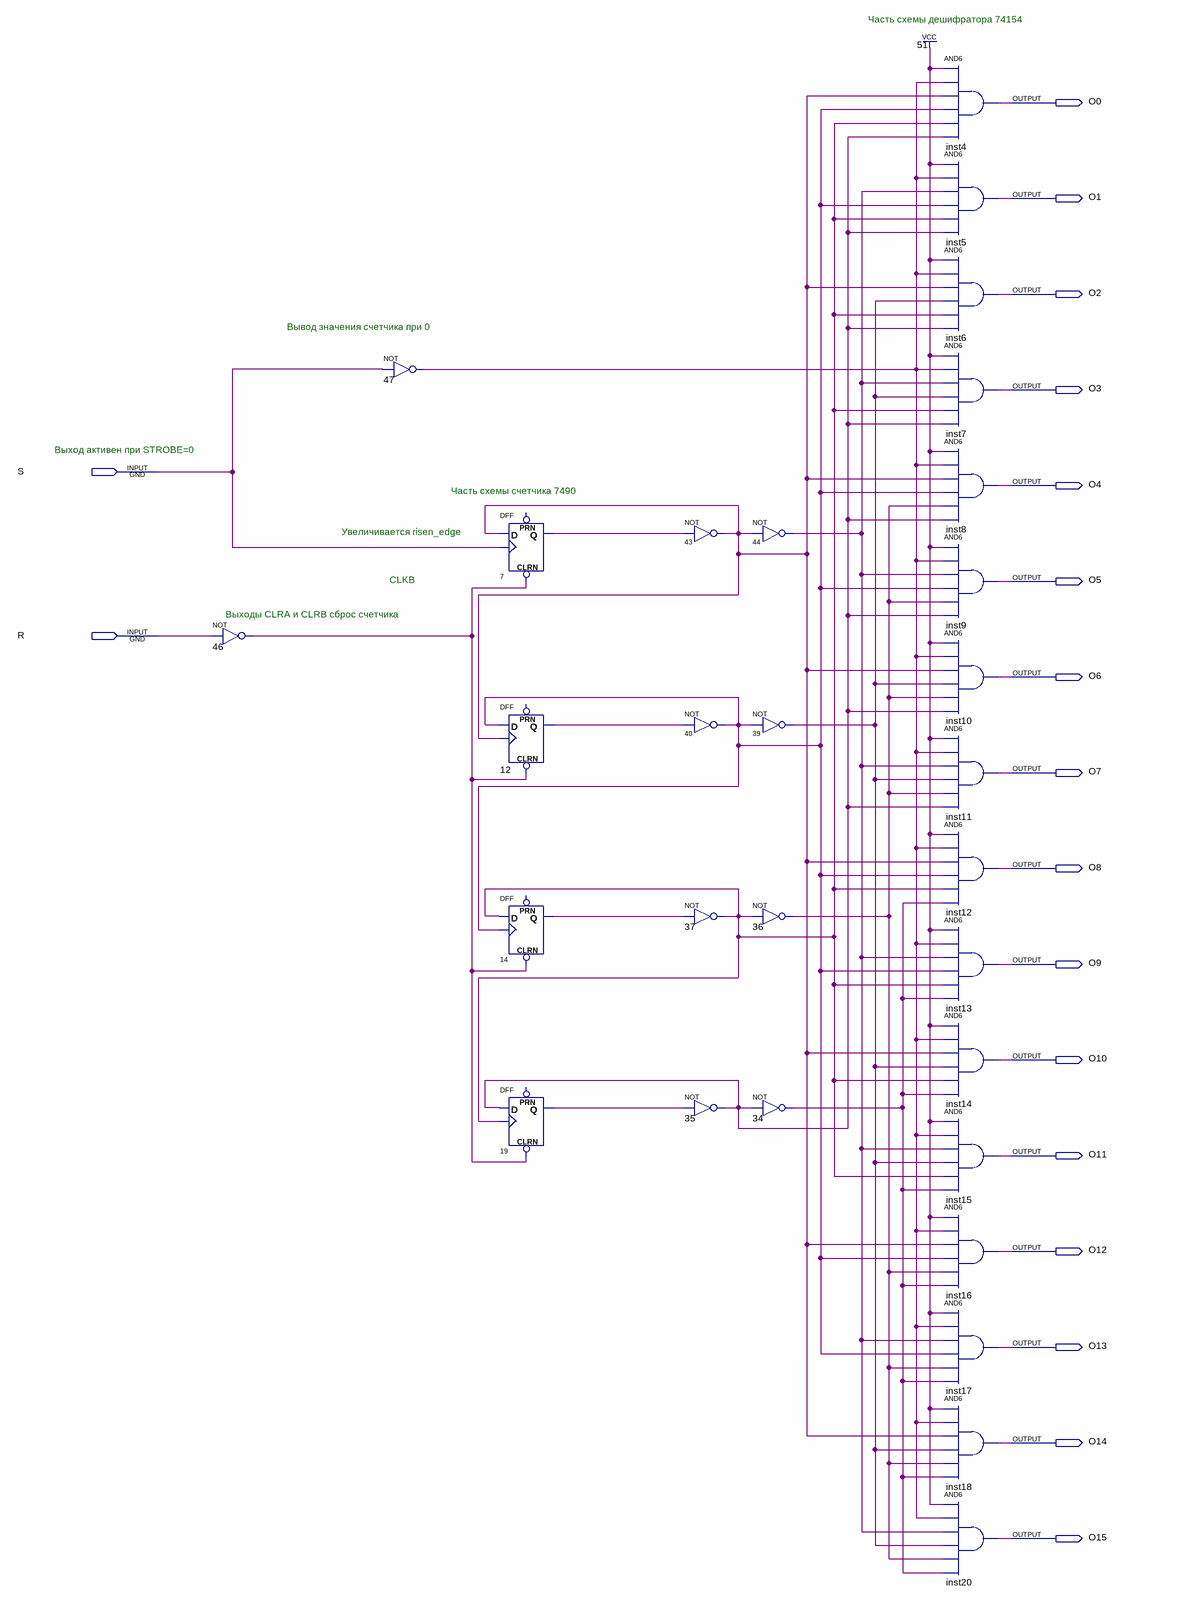
[diagram p0: schematic sheet]
// Quartus schematic counter_pic.bdf as structural Verilog: 30 symbols, 18 pins
module counter_pic (
  input  S,
  input  R,
  output O0,
  output O1,
  output O2,
  output O3,
  output O4,
  output O5,
  output O6,
  output O7,
  output O8,
  output O9,
  output O10,
  output O11,
  output O12,
  output O13,
  output O14,
  output O15
);

  wire n7_q, n12_q, n14_q, n19_q, n34_out, n35_out, n36_out, n37_out, n39_out, n40_out, n43_out, n44_out,
       n46_out, n47_out;

  not u_46 (n46_out, R);
  not u_47 (n47_out, S);
  DFF u_7 (.CLRN(n46_out), .CLK(S), .D(n43_out), .Q(n7_q));  // open: PRN
  DFF u_12 (.CLRN(n46_out), .CLK(n43_out), .D(n40_out), .Q(n12_q));  // open: PRN
  DFF u_14 (.CLRN(n46_out), .CLK(n40_out), .D(n37_out), .Q(n14_q));  // open: PRN
  DFF u_19 (.CLRN(n46_out), .CLK(n37_out), .D(n35_out), .Q(n19_q));  // open: PRN
  not u_43 (n43_out, n7_q);
  not u_40 (n40_out, n12_q);
  not u_37 (n37_out, n14_q);
  not u_35 (n35_out, n19_q);
  not u_44 (n44_out, n43_out);
  not u_39 (n39_out, n40_out);
  not u_36 (n36_out, n37_out);
  not u_34 (n34_out, n35_out);
  and inst4 (O0, 1'b1, n47_out, n43_out, n40_out, n37_out, n35_out);
  and inst5 (O1, 1'b1, n47_out, n44_out, n40_out, n37_out, n35_out);
  and inst6 (O2, 1'b1, n47_out, n43_out, n39_out, n37_out, n35_out);
  and inst7 (O3, 1'b1, n47_out, n44_out, n39_out, n37_out, n35_out);
  and inst8 (O4, 1'b1, n47_out, n43_out, n40_out, n36_out, n35_out);
  and inst9 (O5, 1'b1, n47_out, n44_out, n40_out, n36_out, n35_out);
  and inst10 (O6, 1'b1, n47_out, n43_out, n39_out, n36_out, n35_out);
  and inst11 (O7, 1'b1, n47_out, n44_out, n39_out, n36_out, n35_out);
  and inst12 (O8, 1'b1, n47_out, n43_out, n40_out, n37_out, n34_out);
  and inst13 (O9, 1'b1, n47_out, n44_out, n40_out, n37_out, n34_out);
  and inst14 (O10, 1'b1, n47_out, n43_out, n39_out, n37_out, n34_out);
  and inst15 (O11, 1'b1, n47_out, n44_out, n39_out, n37_out, n34_out);
  and inst16 (O12, 1'b1, n47_out, n43_out, n40_out, n36_out, n34_out);
  and inst17 (O13, 1'b1, n47_out, n44_out, n40_out, n36_out, n34_out);
  and inst18 (O14, 1'b1, n47_out, n43_out, n39_out, n36_out, n34_out);
  and inst20 (O15, 1'b1, n47_out, n44_out, n39_out, n36_out, n34_out);

  // Notes on the sheet:
  //   Часть схемы дешифратора 74154
  //   Вывод значения счетчика при 0
  //   Выход активен при STROBE=0
  //   Часть схемы счетчика 7490
  //   Увеличивается risen_edge
  //   CLKB
  //   Выходы CLRA и CLRB сброс счетчика
endmodule
